# EAGLE design 555 (EAGLE 9.5.2)
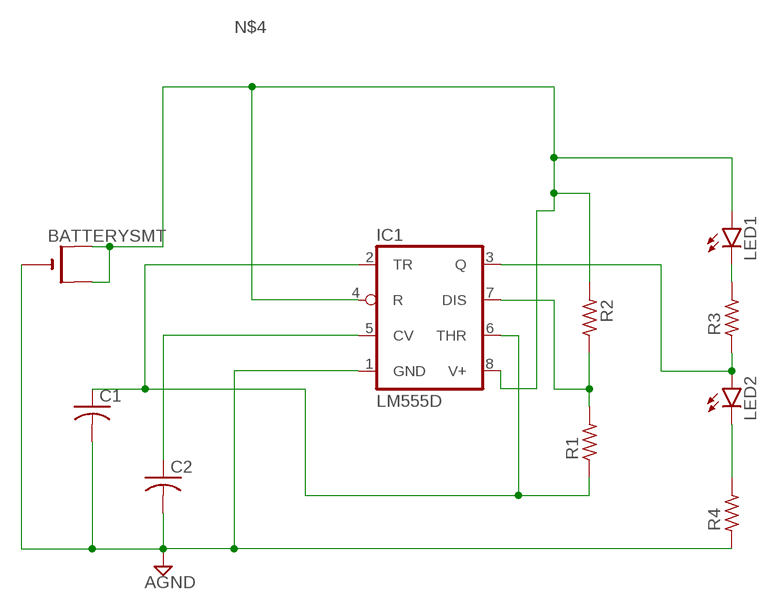
[diagram p0: schematic, sheet 1]

## Parts
BATTERYSMT  CR1220SMT  [CR1220-SMD]
C1  C-USC0805  [C0805]
C2  C-USC0805  [C0805]
IC1  LM555D  [SO08]
LED1  LEDCHIP-LED0805  [CHIP-LED0805]
LED2  LEDCHIP-LED0805  [CHIP-LED0805]
R1  R_0805  [R0805]
R2  R_0805  [R0805]
R3  R_0805  [R0805]
R4  R_0805  [R0805]

## Nets
AGND: BATTERYSMT.- C1.2 C2.2 IC1.1(GND) R4.1
N$1: C2.1 IC1.5(CV)
N$2: C1.1 IC1.2(TR) IC1.6(THR) R1.1
N$3: IC1.7(DIS) R1.2 R2.2
N$4: BATTERYSMT.+$1(+) BATTERYSMT.+$2(+1) IC1.4(R) IC1.8(V+) LED1.A R2.1
N$5: IC1.3(Q) LED2.A R3.1
N$6: LED1.C R3.2
N$7: LED2.C R4.2

## Library data of the parts
BATTERYSMT = adafruit:CR1220: CR1216/CR1220/CR1225 12mm 3V lithium coin cell Great for battery packup. Both SMT and THM holders. Note the THM package has the ground pads on both sides of the PCB so that the masks are the same - this reduces the cost
C1 C2 = adafruit:C-US: CAPACITOR, American symbol
IC1 = adafruit:*555: TIMER Changed DIP package to have round (not oval) pin pads http://www.ladyada.net/library/pcb/eaglelibrary.html
LED1 LED2 = led:LED: LED OSRAM: - CHIPLED LG R971, LG N971, LY N971, LG Q971, LY Q971, LO R971, LY R971 LH N974, LH R974 LS Q976, LO Q976, LY Q976 LO Q996 - Hyper CHIPLED LW Q18S LB Q993, LB Q99A, LB R99A - SideLED LS A670, LO A670, LY A670, LG A670, LP A670 LB A673, LV A673, LT A673, LW A673 LH A674 LY A675 LS A676, LA A676, LO A676, LY A676, LW A676 LS A679, LY A679, LG A679 - Hyper Micro SIDELED® LS Y876, LA Y876, LO Y876, LY Y876 LT Y87S - SmartLED LW L88C, LW L88S LB L89C, LB L89S, LG L890 LS L89K, LO L89K, LY L89K LS L896, LA L896, LO L896, LY L896 - TOPLED LS T670, LO T670, LY T670, LG T670, LP T670 LSG T670, LSP T670, LSY T670, LOP T670, LYG T670 LG T671, LOG T671, LSG T671 LB T673, LV T673, LT T673, LW T673 LH T674 LS T676, LA T676, LO T676, LY T676, LB T676, LH T676, LSB T676, LW T676 LB T67C, LV T67C, LT T67C, LS T67K, LO T67K, LY T67K, LW E67C LS E67B, LA E67B, LO E67B, LY E67B, LB E67C, LV E67C, LT E67C LW T67C LS T679, LY T679, LG T679 LS T770, LO T770, LY T770, LG T770, LP T770 LB T773, LV T773, LT T773, LW T773 LH T774 LS E675, LA E675, LY E675, LS T675 LS T776, LA T776, LO T776, LY T776, LB T776 LHGB T686 LT T68C, LB T68C - Hyper Mini TOPLED® LB M676 - Mini TOPLED Santana® LG M470 LS M47K, LO M47K, LY M47K Source: http://www.osram.convergy.de LUXEON: - LUMILED® LXK2-PW12-R00, LXK2-PW12-S00, LXK2-PW14-U00, LXK2-PW14-V00 LXK2-PM12-R00, LXK2-PM12-S00, LXK2-PM14-U00 LXK2-PE12-Q00, LXK2-PE12-R00, LXK2-PE12-S00, LXK2-PE14-T00, LXK2-PE14-U00 LXK2-PB12-K00, LXK2-PB12-L00, LXK2-PB12-M00, LXK2-PB14-N00, LXK2-PB14-P00, LXK2-PB14-Q00 LXK2-PR12-L00, LXK2-PR12-M00, LXK2-PR14-Q00, LXK2-PR14-R00 LXK2-PD12-Q00, LXK2-PD12-R00, LXK2-PD12-S00 LXK2-PH12-R00, LXK2-PH12-S00 LXK2-PL12-P00, LXK2-PL12-Q00, LXK2-PL12-R00 Source: www.luxeon.com KINGBRIGHT: KA-3528ASYC Source: www.kingbright.com
R1-R4 = cap_master-smd:R_: RESISTOR

## Board
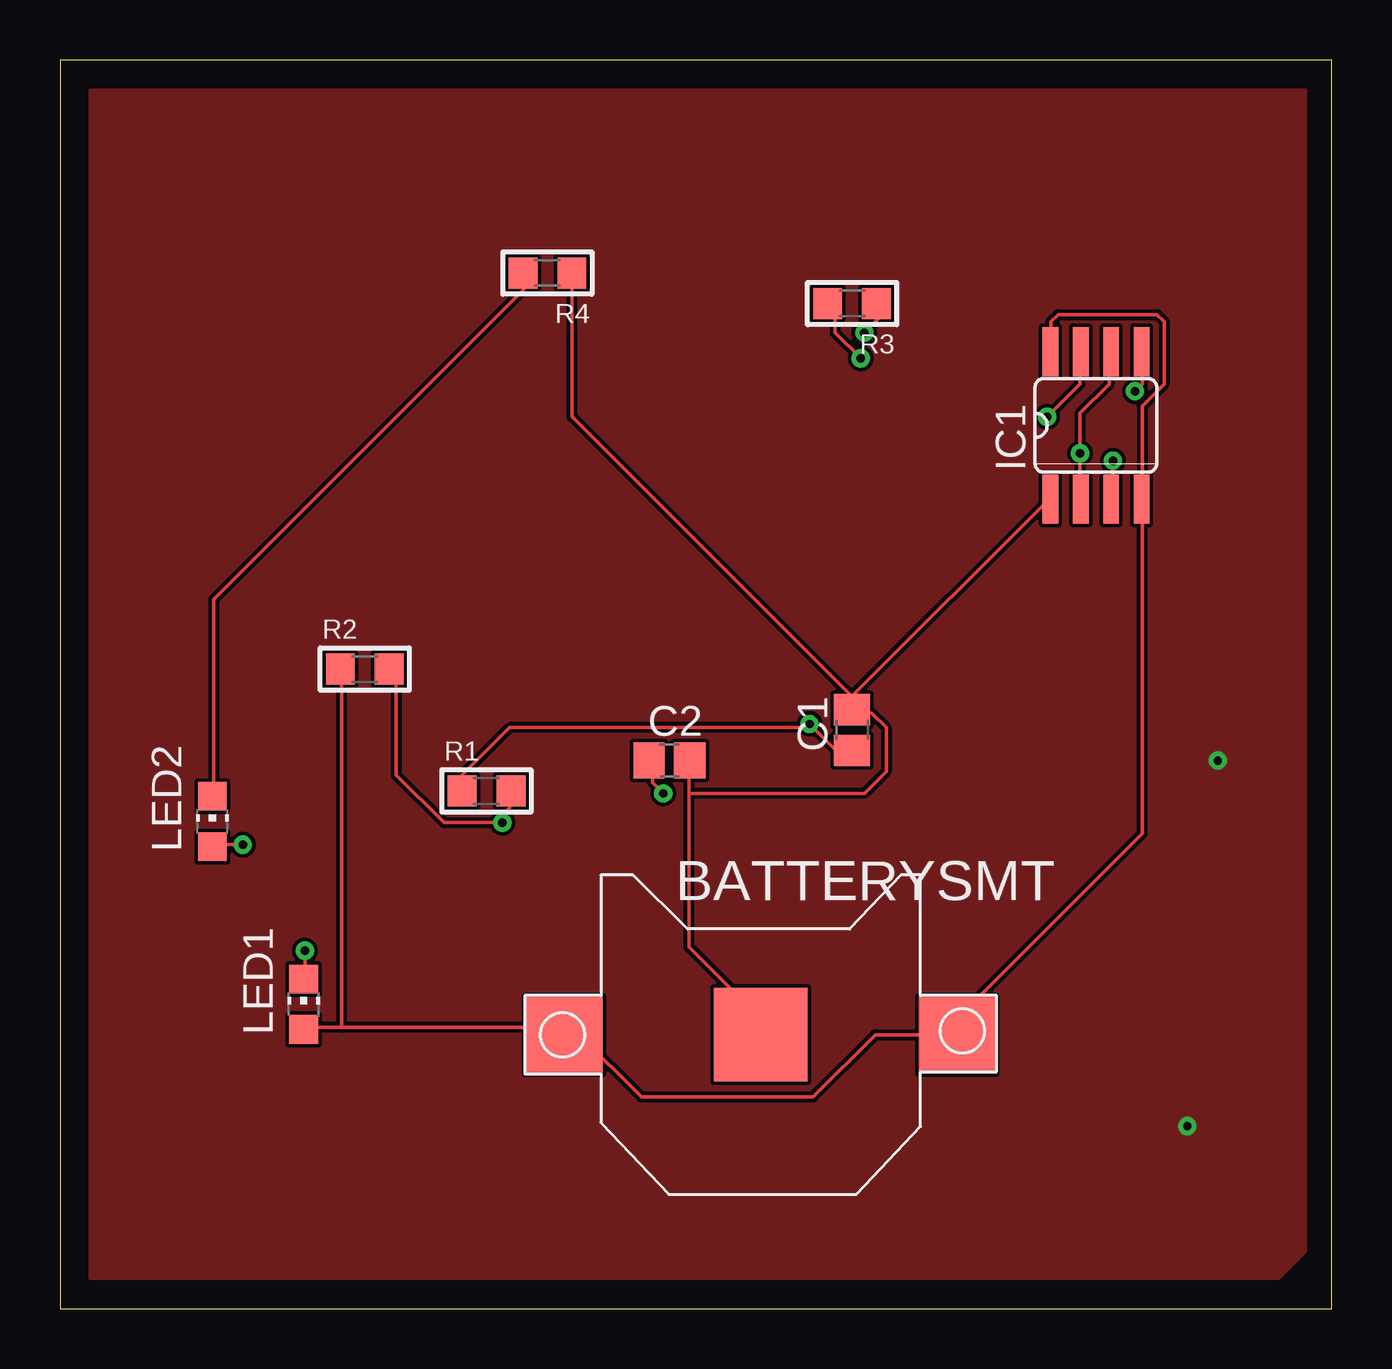
[diagram p1: board, top side]
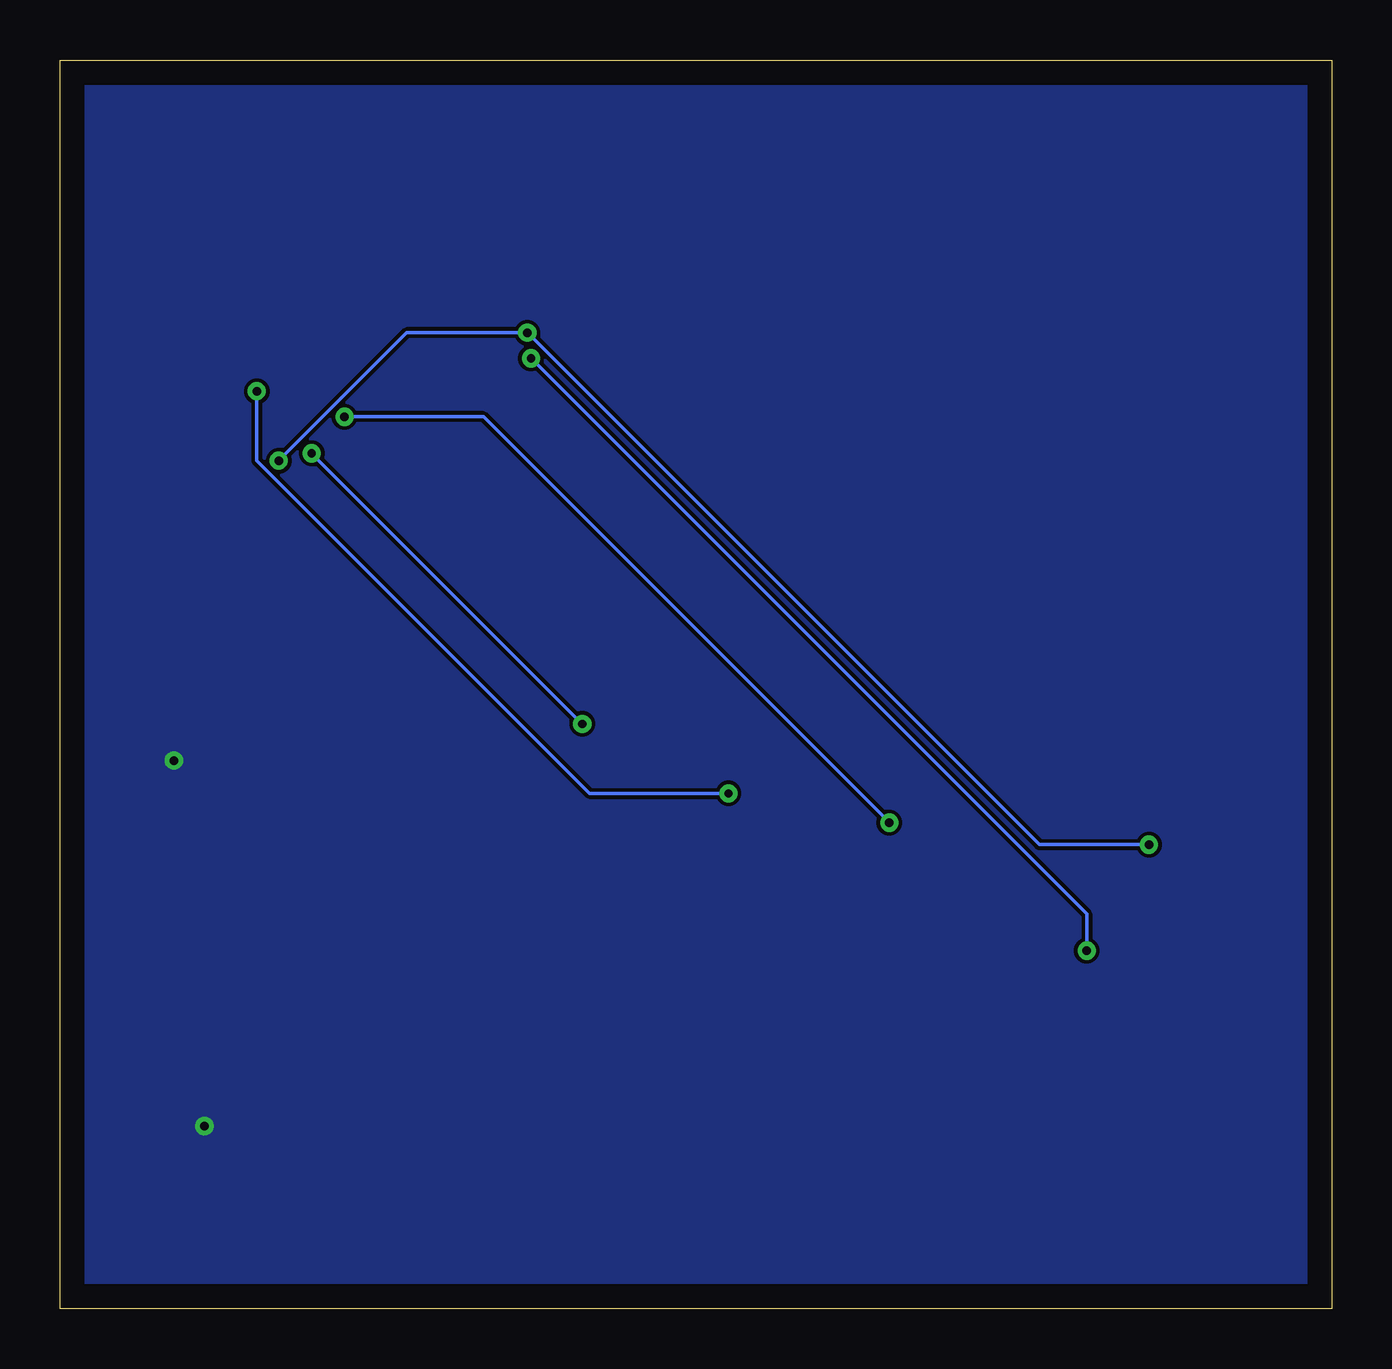
[diagram p2: board, bottom side, seen from below]

Size 53.01 x 52.06 mm. Coordinates in mm from the lower left corner, seen from the top.
Outline: 0,0 53.01,0 53.01,52.06 0,52.06 0,0
Copper layers (1*16): Top 0.035mm / dielectric 1.5mm / Bottom 0.035mm
Design rules "default": minimum track width 6mil, minimum drill 0.35mm, track to track 6mil, track to pad 6mil, pad to pad 6mil, via to via 6mil, smd to smd 6mil, copper to edge 40mil, drill to drill 6mil, minimum pad ring 10mil, minimum via ring 8mil, stop-mask expansion 4mil, vias tented up to drill 0mil, thermal gap 10mil

### Footprints (pad centres in the part's own frame; a part is rotated, then mirrored left to right if it is on the bottom)
CR1220-SMD = smd 3.2 x 3.2: +$1 -8.2,0; +$2 8.2,0 | smd 3.9 x 3.9: - 0,0
C0805 = smd 1.3 x 1.5: 1 -0.85,0; 2 0.85,0
SO08 = smd 0.66 x 2.032: 1 -1.905,-3.073; 2 -0.635,-3.073; 3 0.635,-3.073; 4 1.905,-3.073; 5 1.905,3.073; 6 0.635,3.073; 7 -0.635,3.073; 8 -1.905,3.073
CHIP-LED0805 = smd 1.2 x 1.2: A 0,-1.05; C 0,1.05
R0805 = smd 1.2 x 1.3: 1 -1.016,0; 2 1.016,0

### Placement (x,y rotation side)
BATTERYSMT  29.21,11.43 0 top
C1  33.02,24.13 90 top
C2  25.4,22.86 0 top
IC1  43.18,36.83 0 top
LED1  10.16,12.7 0 top
LED2  6.35,20.32 0 top
R1  17.78,21.59 0 top
R2  12.7,26.67 0 top
R3  33.02,41.91 180 top
R4  20.32,43.18 180 top

### Tracks (layer width: path | path; a pad name or v marks a point on that pad's centre or on a via)
AGND
  Top 0.152: 26.21,21.49 26.21,15.09 29.11,12.19 29.11,11.43 BATTERYSMT.- | 26.21,21.49 26.21,22.86 C2.2 | R4.1 21.34,37.19 32.92,25.6 32.92,25.3 | 32.92,25.3 32.92,24.99 C1.2 | 32.92,25.3 33.07,25.45 33.07,25.6 41.15,33.68 IC1.1 | 32.92,25.3 C1.2 | 26.21,21.49 33.53,21.49 34.44,22.4 34.44,24.23 33.83,24.84 33.07,24.84 C1.2
GND  (via drill 0.35)
  other vias: 46.99,7.62 48.26,22.86
  pour Top: 1.27,50.8 1.27,1.27 50.8,1.27 52.07,2.54 52.07,50.8
  pour Bottom: -1.27,52.07 -1.27,-1.27 -2.54,-2.54 53.34,-2.54 54.61,-1.27 54.61,53.34 -1.27,53.34
N$1  (via drill 0.35)
  Top 0.152: v25.15,21.49 24.69,21.95 24.69,22.86 C2.1 | v44.81,38.25 45.11,38.56 45.11,39.78 IC1.5
  Bottom 0.152: v25.15,21.49 30.94,21.49 44.81,35.36 v44.81,38.25
N$2  (via drill 0.35)
  Top 0.152: IC1.2 42.52,33.83 v42.52,35.66 42.52,37.34 43.74,38.56 43.74,39.78 IC1.6 | R1.1 16.76,22.25 18.75,24.23 31.24,24.23 | 31.24,24.23 31.39,24.23 32.31,23.32 32.92,23.32 C1.1 | 31.24,24.23 v31.24,24.38
  Bottom 0.152: v31.24,24.38 v42.52,35.66
N$3  (via drill 0.35)
  Top 0.152: 18.29,20.42 18.14,20.27 16,20.27 14.02,22.25 14.02,26.36 R2.2 | 18.29,20.42 18.75,20.88 18.75,21.49 R1.2 | v41.15,37.19 42.52,38.56 42.52,39.78 IC1.7 | 18.29,20.42 v18.44,20.27
  Bottom 0.152: v41.15,37.19 35.36,37.19 v18.44,20.27
N$4
  Top 0.152: IC1.8 41.3,39.93 41.3,41.15 41.6,41.45 45.72,41.45 46.02,41.15 46.02,38.56 45.11,37.64 45.11,33.83 IC1.4 45.11,33.68 45.11,19.81 37.49,12.19 37.49,11.43 BATTERYSMT.+$2 33.98,11.43 31.39,8.84 24.23,8.84 21.64,11.43 BATTERYSMT.+$1 20.88,11.43 20.57,11.73 11.73,11.73 | 11.73,11.73 10.21,11.73 LED1.A | 11.73,11.73 11.73,26.67 R2.1
N$5  (via drill 0.35)
  Top 0.152: v7.62,19.36 6.4,19.36 LED2.A | v33.53,40.69 34.14,41.3 34.14,41.91 R3.1 | v43.89,35.36 43.89,33.83 IC1.3
  Bottom 0.152: v7.62,19.36 12.19,19.36 v33.53,40.69 38.56,40.69 v43.89,35.36
N$6  (via drill 0.35)
  Top 0.152: v10.21,14.94 10.21,13.87 LED1.C | v33.38,39.62 32.31,40.69 32.31,41.6 R3.2
  Bottom 0.152: v10.21,14.94 10.21,16.46 v33.38,39.62
N$7
  Top 0.152: LED2.C 6.4,21.49 6.4,29.57 19.36,42.52 19.36,43.13 R4.2